# EAGLE schematic halfAdder (EAGLE 7.4.0)
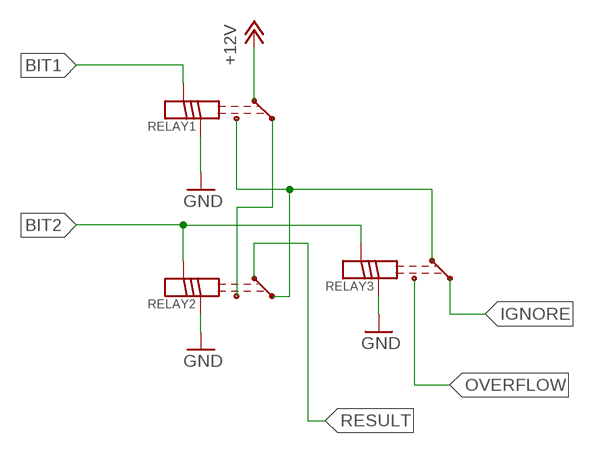
[diagram p0: schematic, sheet 1]

## Parts
RELAY1  basicRelay  RELAY-GENERIC  [RELAY-FINDER-40.51]
RELAY2  basicRelay  RELAY-GENERIC  [RELAY-FINDER-40.51]
RELAY3  basicRelay  RELAY-GENERIC  [RELAY-FINDER-40.51]

## Nets
+12V: RELAY1.CENTER
BIT1: RELAY1.N+
BIT2: RELAY2.N+ RELAY3.N+
GND: RELAY1.N- RELAY2.N- RELAY3.N-
IGNORE: RELAY3.NCL
N$1: RELAY1.NOP RELAY2.NCL RELAY3.CENTER
N$2: RELAY1.NCL RELAY2.NOP
OVERFLOW: RELAY3.NOP
RESULT: RELAY2.CENTER

## Library data of the parts
RELAY1-RELAY3 = p.peter-scoville.tests:RELAY-GENERIC; SV_SPICE_ORDER: NOP;CENTER;NCL;N+;N-; SV_SPICE_PREFIX: x; SV_SPICE_SUBCKT: .subckt %NAME% 1 2 3 4 5\nSOpen 1 2 4 5 SW_OPEN on\nSClosed 2 3 4 5 SW_CLOSED on\n* Some pulldowns, to make sure nothing is floating\nR1 1 GND 10k\nR2 2 GND 10k\nR3 3 GND 10k\nR4 4 GND 10k\nR5 5 GND 10k\n.model SW_OPEN SW(Ron=.1 Roff=1Meg Vt=6 )\n.model SW_CLOSED SW(Ron=1Meg Roff=.1 Vt=6 )\n.ends